# Altium schematic sheet Temp_sense.SchDoc
size A; SheetNumber: 4; SheetTotal: 16
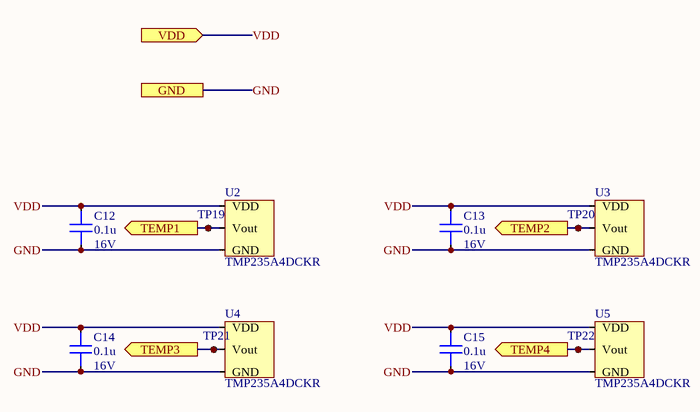
[diagram p0: Temp_sense.SchDoc]

## Parts
C12  value 0.1u  Voltage: 16V  [0603_CAP]  (hidden comment: Capacitor)
C13  value 0.1u  Voltage: 16V  [0603_CAP]  (hidden comment: Capacitor)
C14  value 0.1u  Voltage: 16V  [0603_CAP]  (hidden comment: Capacitor)
C15  value 0.1u  Voltage: 16V  [0603_CAP]  (hidden comment: Capacitor)
TP19  1mm Testpoint  [1mm_testpoint]  (value not drawn)
TP20  1mm Testpoint  [1mm_testpoint]  (value not drawn)
TP21  1mm Testpoint  [1mm_testpoint]  (value not drawn)
TP22  1mm Testpoint  [1mm_testpoint]  (value not drawn)
U2  TMP235A4DCKR  [SOT23-3]
U3  TMP235A4DCKR  [SOT23-3]
U4  TMP235A4DCKR  [SOT23-3]
U5  TMP235A4DCKR  [SOT23-3]

## Ports
GND, TEMP1 (out), TEMP2 (out), TEMP3 (out), TEMP4 (out), VDD (in)

## Nets
GND: C12.1 C13.1 C14.1 C15.1 U2.3(GND) U3.3(GND) U4.3(GND) U5.3(GND) ; port GND
TEMP1: TP19.1 U2.2(Vout) ; port TEMP1
TEMP2: TP20.1 U3.2(Vout) ; port TEMP2
TEMP3: TP21.1 U4.2(Vout) ; port TEMP3
TEMP4: TP22.1 U5.2(Vout) ; port TEMP4
VDD: C12.2 C13.2 C14.2 C15.2 U2.1(VDD) U3.1(VDD) U4.1(VDD) U5.1(VDD) ; port VDD

## Library data of the parts
TP19-TP22 = 1mm Testpoint: 1mm test point; ComponentLink1Description: Digikey; ComponentLink1URL: https://www.digikey.com/product-detail/en/te-connectivity-amp-connectors/RCU-0C/A106145CT-ND/3477802
U2-U5 = TMP235A4DCKR: Temperature Sensor Analog, Local -40°C ~ 150°C 10mV/°C SOT-23-3; ComponentLink1Description: Digikey; ComponentLink1URL: https://www.digikey.com/en/products/detail/texas-instruments/TMP235A4DBZR/9649794
C12-C15 = Capacitor: Dielectric: *; Percent Tolerance: *; ESR: *